# Altium schematic sheet Pasa_bandas.SchDoc
size A; SheetNumber: 3; SheetTotal: 4
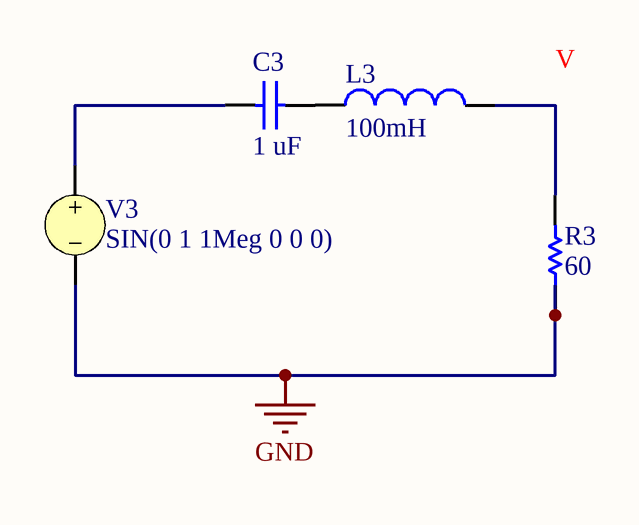
[diagram p0: Pasa_bandas.SchDoc]

## Parts
C3  value 1 uF  (hidden comment: Capacitor)
L3  value 100mH  (hidden comment: Inductor)
R3  value 60  (hidden comment: Resistor)
V3  SIN(0 1 1Meg 0 0 0)

## Nets
GND: R3.1 V3.2
NetC3_1: C3.1 V3.1
NetC3_2: C3.2 L3.1
NetL3_2: L3.2 R3.2

## Library data of the parts
C3 = Capacitor: SimulationGenericComponent: True
L3 = Inductor: SimulationGenericComponent: True
R3 = Resistor: TC1: 0; SimulationGenericComponent: True; TC2: 0
V3 = VSRC: Voltage Source; Note: PCB Footprint - Not required; AC Magnitude: 1; AC Phase: 0; Published: 8-Jun-2000; LatestRevisionDate: 17-Jul-2002; LatestRevisionNote: Re-released for DXP Platform.; PackageReference: Not Applicable; Publisher: Altium Limited; DC Magnitude: 1; Offset: 0; Amplitude: 1; Frequency: 1Meg; Delay: 0; Damping Factor: 0; Phase: 0